# Altium schematic sheet Source_OPV_ADC.SchDoc
size A4; Organization: HTL Hollabrunn; Address1: Abteilung Elektronik; Address2: Anton Ehrenfried-Straße 10; Address3: 2020 Hollabrunn; SheetNumber: 1; SheetTotal: 1; SPICEModelCacheDVQSEWCR: <root> / <DocumentId>DVQSEWCR</DocumentId> / <CacheFrame Number="0"> / <Model Name="ua741" Kind="CKT"> / <Text>*==================================================== / *uA741 / *Sngl GenPurpose OpAmp pkg:DIP8 3,2,7,4,6. pkg:CAN8 3,2,7,4,6. / * Connections: / *             Non-Inverting Input / *             | Inverting Input / *             | | Positive Power Supply / *             | | | Negative Power Supply / *             | | | | Output / *             | | | | | / .SUBCKT UA741 1 2 3 4 5 / C1   11 12 4.664E-12 / C2    6  7 20E-12 / DC    5 53 DX / DE   54  5 DX / DLP  90 91 DX / DLN  92 90 DX / DP    4  3 DX / BGND 99  0 V=V(3)*.5 + V(4)*.5 / BB    7 99 I=I(VB)*10.61E6 - I(VC)*10E6 + I(VE)*10E6 + / +              I(VLP)*10E6 - I(VLN)*10E6 / GA    6  0 11 12 137.7E-6 / GCM   0  6 10 99 2.574E-9 / IEE  10  4 DC 10.16E-6 / HLIM 90  0 VLIM 1K / Q1   11  2 13 QX / Q2   12  1 14 QX / R2    6  9 100E3 / RC1   3 11 7.957E3 / RC2   3 12 7.957E3 / RE1  13 10 2.74E3 / RE2  14 10 2.74E3 / REE  10 99 19.69E6 / RO1   8  5 150 / RO2   7 99 150 / RP    3  4 18.11E3 / VB    9  0 DC 0 / VC    3 53 DC 2.6 / VE   54  4 DC 2.6 / VLIM  7  8 DC 0 / VLP  91  0 DC 25 / VLN   0 92 DC 25 / .MODEL DX D(IS=800E-18) / .MODEL QX NPN(IS=800E-18 BF=62.5) / .ENDS UA741</Text> / </Model> / <Model Name="cap" Kind="MDL"> / <Text>*Default semiconductor capacitor / .MODEL CAP C()</Text> / </Model> / </CacheFrame> / </root>
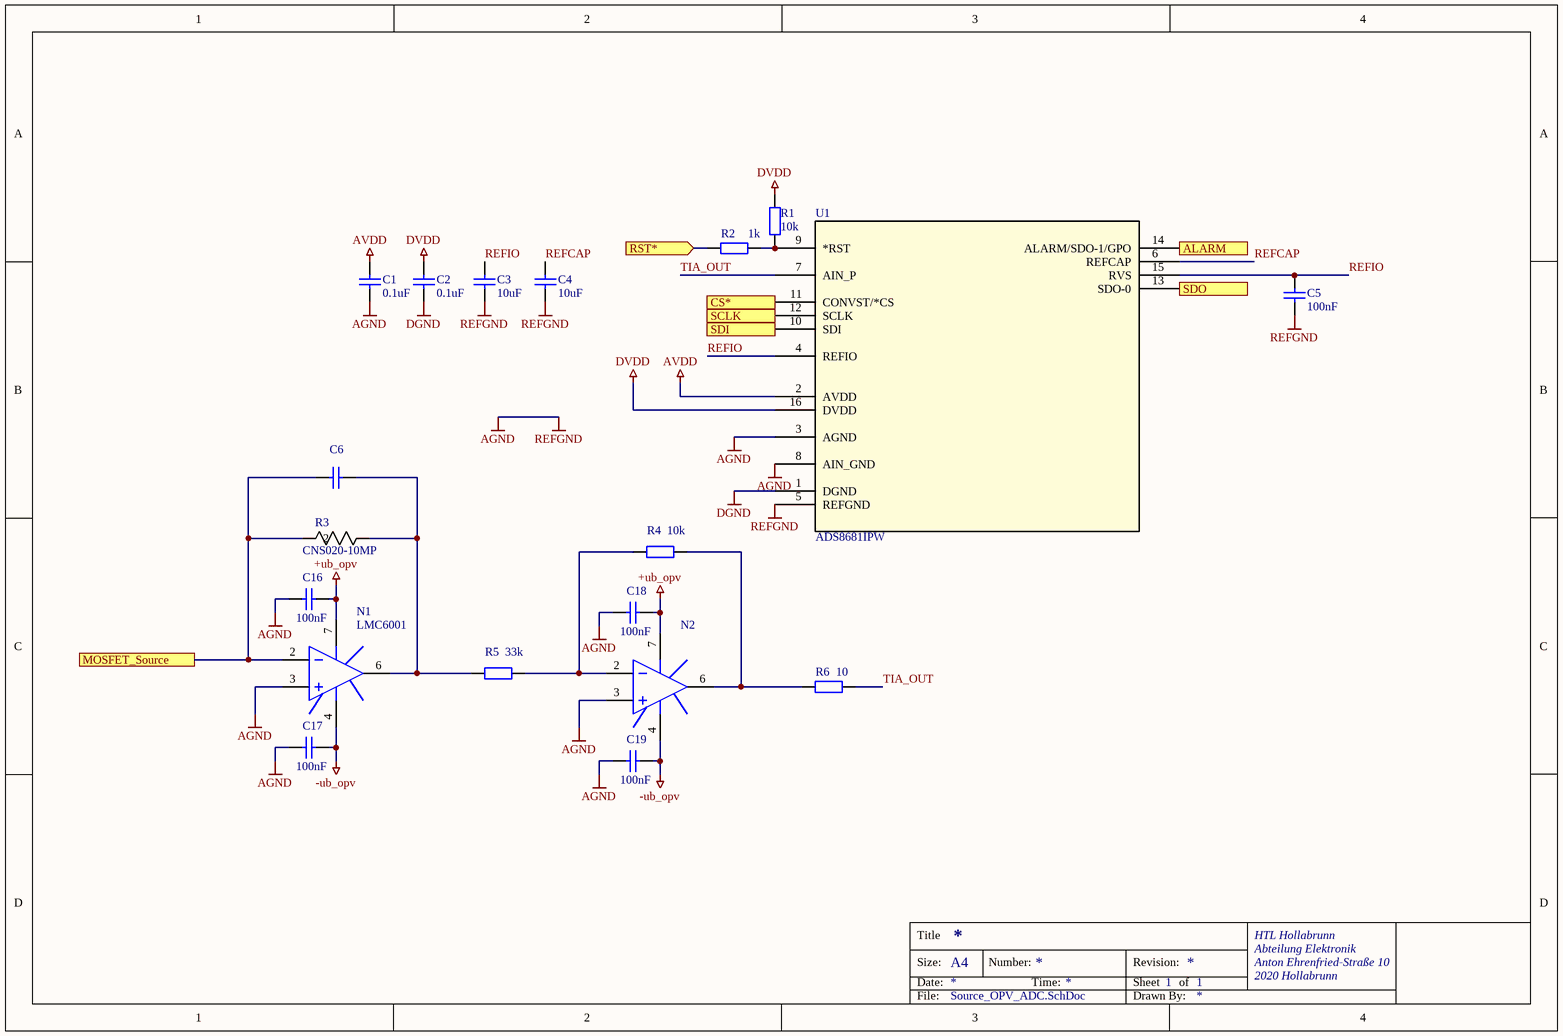
[diagram p0: Source_OPV_ADC.SchDoc]

## Parts
C1  0.1uF  [C1206-KUE]
C2  0.1uF  [C1206-KUE]
C3  10uF  [C1206-KUE]
C4  10uF  [C1206-KUE]
C5  100nF  [C1206-KUE]
C6  100nF  [C1206-KUE]  (value not drawn)
C16  100nF  [C1206-KUE]
C17  100nF  [C1206-KUE]
C18  100nF  [C1206-KUE]
C19  100nF  [C1206-KUE]
N1  LMC6001  [DIP8]
N2  LMC6001  [DIP8]  (value not drawn)
R1  10k  [C1206-KUE]
R2  1k  [C1206-KUE]
R3  CNS020-10MP  [RES_CNS020_VIS]
R4  10k  [C1206-KUE]
R5  33k  [C1206-KUE]
R6  10  [C1206-KUE]
U1  ADS8681IPW  [PW16_TEX]

## Ports
ALARM (out), CS* (in), MOSFET_Source, RST* (in), SCLK (in), SDI (in), SDO (out)

## Nets
+ub_opv: C16.2 C18.2 N1.7(V+) N2.7(V+)
-ub_opv: C17.2 C19.2 N1.4(V-) N2.4(V-)
AGND: C1.1 C3.1 C4.1 C5.1 C16.1 C17.1 C18.1 C19.1 N1.3(IN+) N2.3(IN+) U1.3(AGND) U1.5(REFGND) U1.8(AIN_GND)  [also labelled REFGND]
AVDD: C1.2 U1.2(AVDD)
DGND: C2.1 U1.1(DGND)
DVDD: C2.2 R1.1 U1.16(DVDD)
ALARM: U1.14(ALARM/SDO-1/GPO) ; port ALARM
CS*: U1.11(CONVST/*CS) ; port CS*
MOSFET_Source: C6.1 N1.2(IN-) R3.2 ; port MOSFET_Source
REFCAP: C4.2 U1.6(REFCAP)
REFIO: C3.2 C5.2 U1.4(REFIO) U1.15(RVS)
RST*: R2.1 ; port RST*
SCLK: U1.12(SCLK) ; port SCLK
SDI: U1.10(SDI) ; port SDI
SDO: U1.13(SDO-0) ; port SDO
TIA_OUT: R6.1 U1.7(AIN_P)
NetC6_2: C6.2 N1.6(OUT) R3.1 R5.2
NetN2_2: N2.2(IN-) R4.2 R5.1
NetN2_6: N2.6(OUT) R4.1 R6.2
NetR1_2: R1.2 R2.2 U1.9(*RST)

Not connected (* = marked no-connect by the designer): N1 1(OS_NULL) 5(OS_NULL) 8(NC); N2 1(OS_NULL) 5(OS_NULL) 8(NC)

## Notes on the sheet
- Title
- Size:
- Date:
- A4
- Number:
- Time:
- Revision:
- Sheet
- of
- HTL Hollabrunn
- Abteilung Elektronik
- Anton Ehrenfried-Straße 10
- 2020 Hollabrunn
- File:
- Drawn By:

## Library data of the parts
C1-C6 C16-C19 = Capacitor: Manufacturer: Kemet; Bezeichnung: Kerko +-10% 63V; Published: 8-Jun-2000; LatestRevisionDate: 17-Jul-2002; LatestRevisionNote: Re-released for DXP Platform.; PackageReference: RAD-0.3; Publisher: Altium Limited; PackageDescription: Radial Cap, Thru-Hole; 2 Leads; 0.3 in Pin Spacing; Orderingcode: *
  C1 C2: Value: 0.1uF
  C3 C4: Value: 10uF
  C5 C6 C16-C19: Value: 100nF
N1 N2 = UA741AN: General-Purpose Single Operational Amplifier; Published: 24-Aug-2001; LatestRevisionDate: 06-Jun-2005; LatestRevisionNote: Stylized 3D Model Added.; DatasheetVersion: Oct-1997; PackageReference: DIP8; Publisher: Altium Limited; PackageDescription: DIP; 8 Leads; Row Spacing 7.62 mm; Pitch 2.54 mm; Code_JEDEC: MO-001-AN; ComponentLink1Description: Manufacturer Link; ComponentLink1URL: http://www.st.com/; ComponentLink2Description: Datasheet; ComponentLink2URL: http://www.st.com/stonline/products/literature/ds/5304/ua741.pdf
R1 R2 R4-R6 = ResistorSMD: Resistor SMD; Manufacturer: AVX; Bezeichnung: SMD Wid. 1/8W 2%; Published: 8-Jun-2000; LatestRevisionDate: 17-Jul-2002; LatestRevisionNote: Re-released for DXP Platform.; PackageReference: AXIAL-0.4; Publisher: Altium Limited; PackageDescription: Axial Device, Thru-Hole; 2 Leads; 0.4 in Pin Spacing; Orderingcode: *
  R1 R4: Value: 10k
  R2: Value: 1k
  R5: Value: 33k
  R6: Value: 10
R3 = CNS020-10KP: CNS 020 10K 0,02% e2; Manufacturer_Name: Vishay; Copyright: Copyright (C) 2026 Ultra Librarian. All rights reserved.; Manufacturer_Part_Number: CNS020-10KP; Datasheet: https://www.vishay.com/doc?60051
U1 = ADS8681IPW: 16-bit, 1MSPS 1-ch SAR ADC with programmable (Â±12V, Â±10V, Â±6V, Â±5V, Â±2.5V) input ranges on 5V supply 16-TSSOP -40 to 125; Manufacturer_Name: Texas Instruments; Copyright: Copyright (C) 2025 Ultra Librarian. All rights reserved.; Manufacturer_Part_Number: ADS8681IPW; RefDes: RefDes; Type: Type